# Altium schematic sheet Interfaces.SchDoc
size A2; Organization: Altium Limited; Address1: L3, 12a Rodborough Rd; Address2: Frenchs Forest; Address3: NSW; Address4: Australia 2086
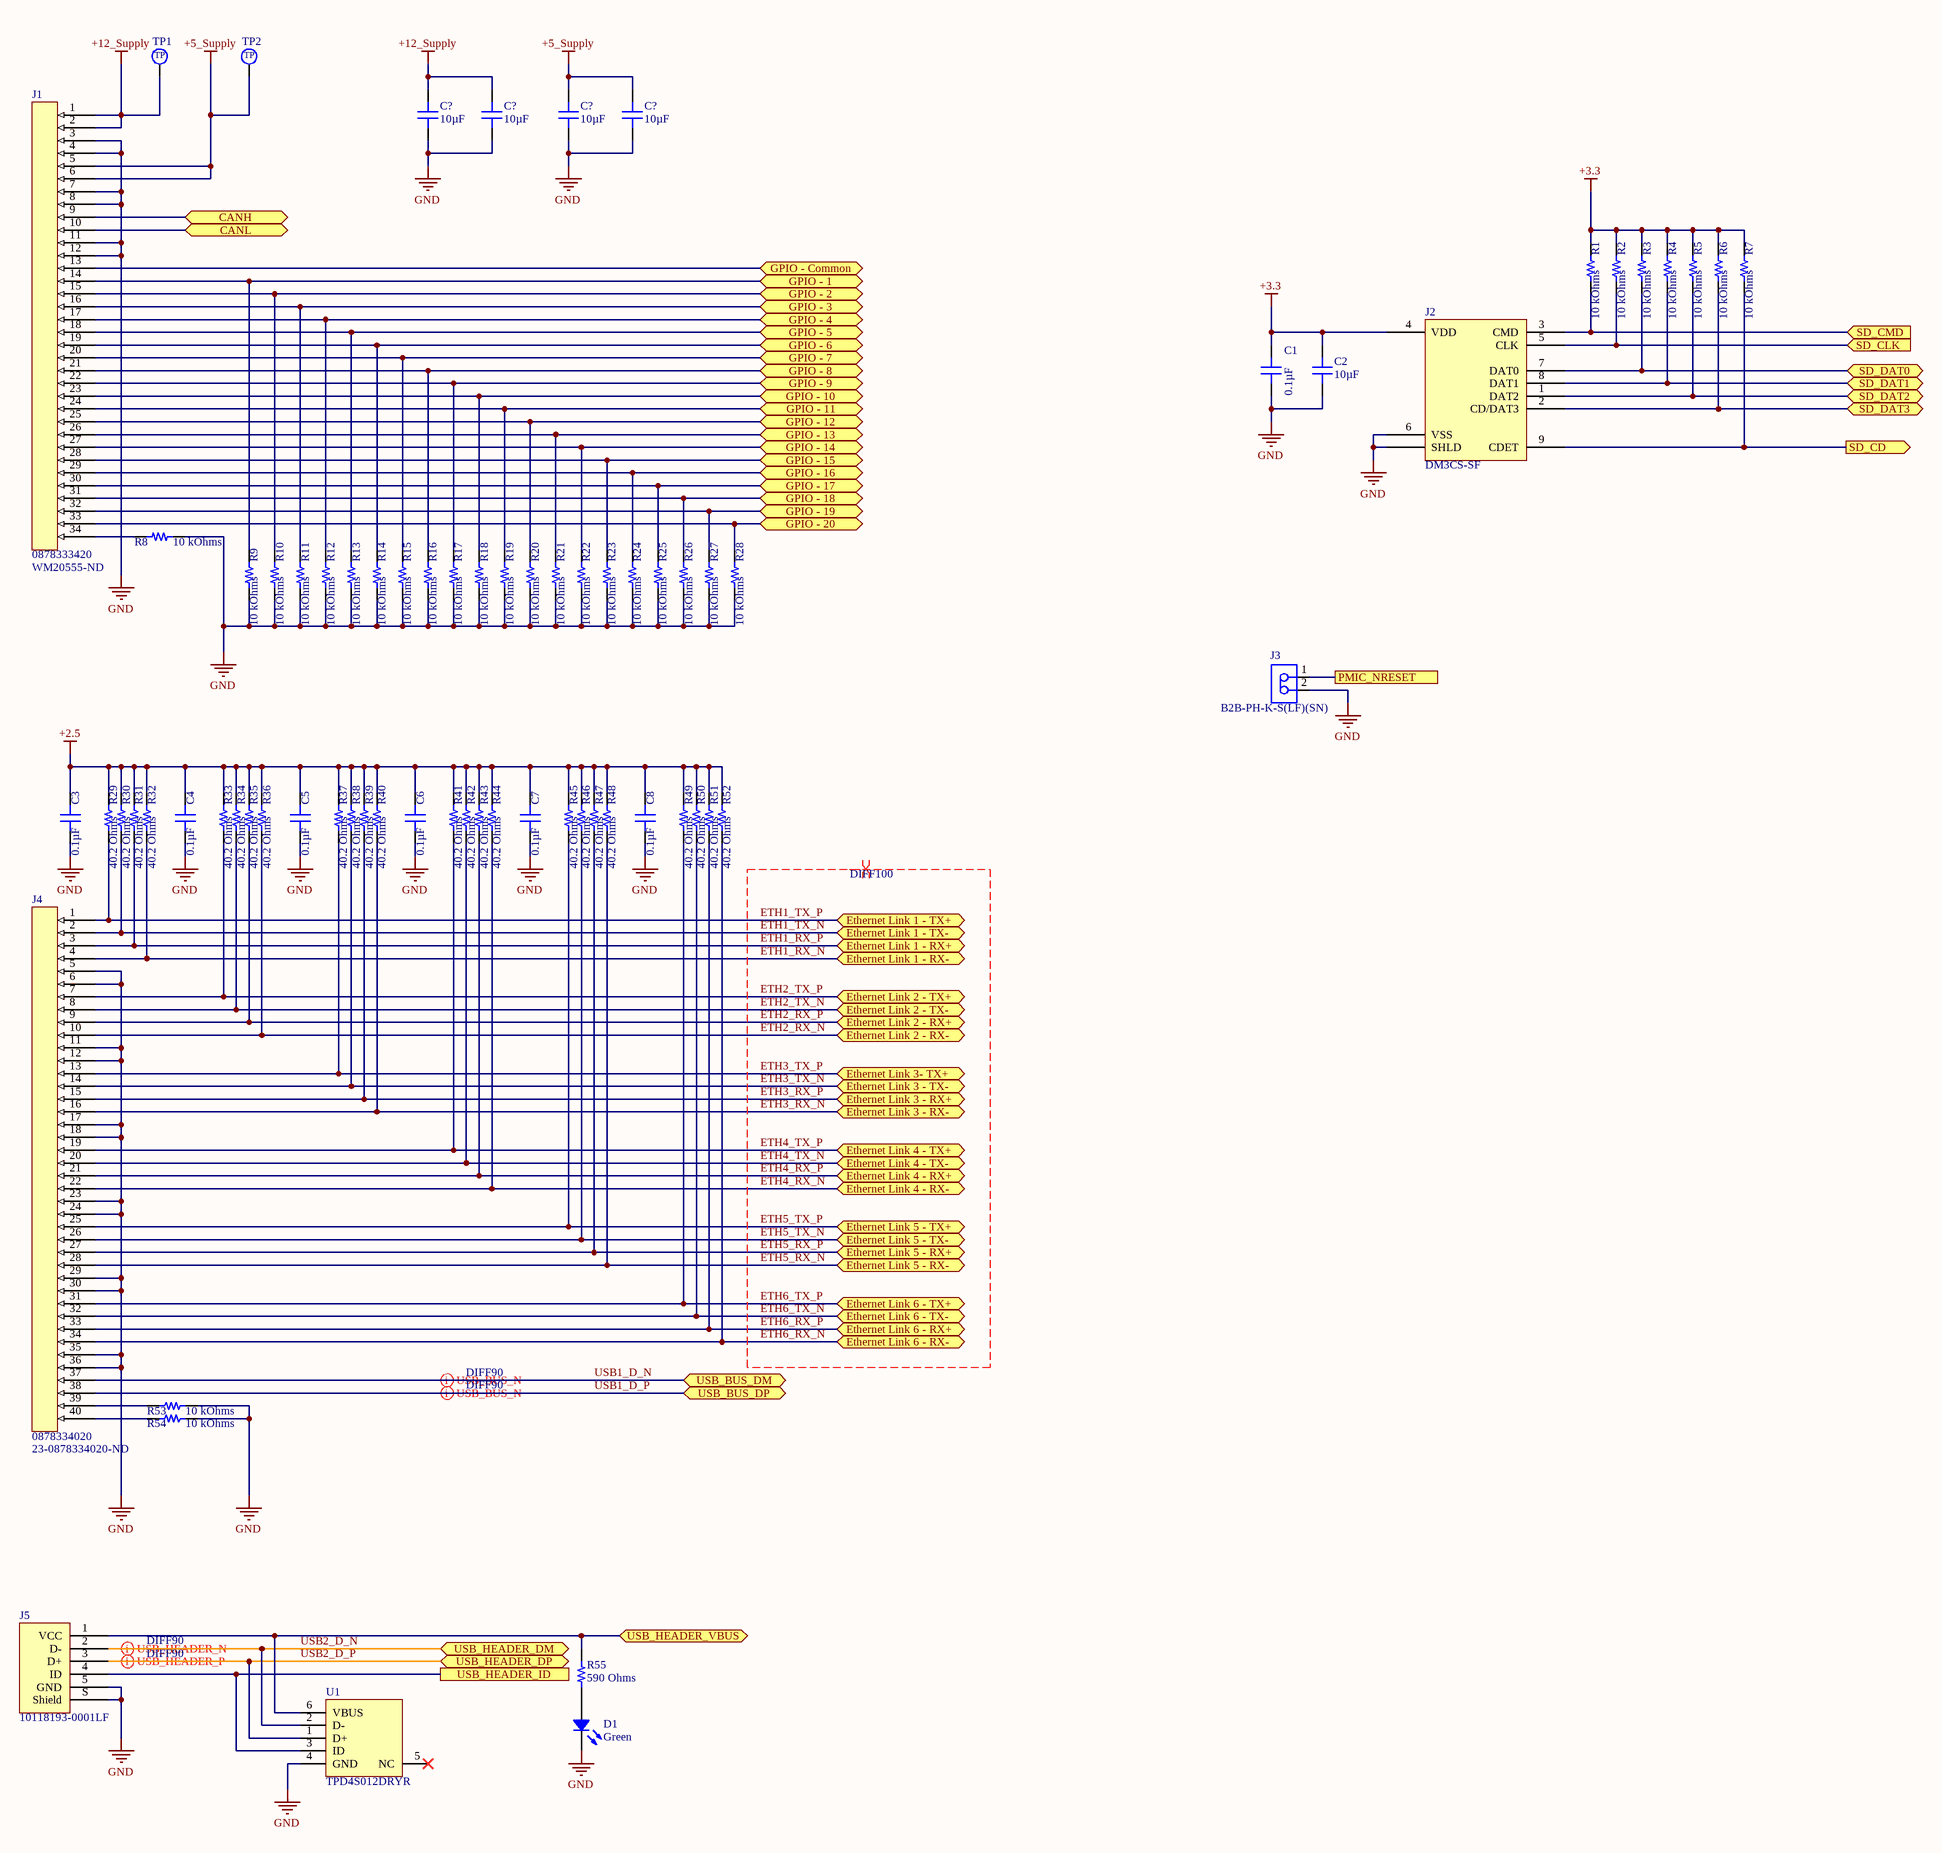
[diagram p0: Interfaces.SchDoc]

## Parts
(Parts that share a designator on the sheet are numbered #1, #2 ... from top to bottom, then left to right.)
C1  0.1µF  [CAP 0603_1608]
C2  10µF  [CAP 0805_2012]
C3  0.1µF  [CAP 0603_1608]
C4  0.1µF  [CAP 0603_1608]
C5  0.1µF  [CAP 0603_1608]
C6  0.1µF  [CAP 0603_1608]
C7  0.1µF  [CAP 0603_1608]
C8  0.1µF  [CAP 0603_1608]
C?#1  10µF  [CAP 0805_2012]
C?#2  10µF  [CAP 0805_2012]
C?#3  10µF  [CAP 0805_2012]
C?#4  10µF  [CAP 0805_2012]
D1  Green  [LED 0603_1608 GREEN]
J1  0878333420  Supplier Part Number 1: WM20555-ND  [0878333420]
J2  DM3CS-SF  [HIROSE DM3CS]
J3  B2B-PH-K-S(LF)(SN)  [JST-B2B-PH-K-S_V]
J4  0878334020  Supplier Part Number 1: 23-0878334020-ND  [0878334020]
J5  10118193-0001LF  [FCI USB 10118193-0001LF]
R1  10 kOhms  [RES 0603_1608]
R2  10 kOhms  [RES 0603_1608]
R3  10 kOhms  [RES 0603_1608]
R4  10 kOhms  [RES 0603_1608]
R5  10 kOhms  [RES 0603_1608]
R6  10 kOhms  [RES 0603_1608]
R7  10 kOhms  [RES 0603_1608]
R8  10 kOhms  [RES 0603_1608]
R9  10 kOhms  [RES 0603_1608]
R10  10 kOhms  [RES 0603_1608]
R11  10 kOhms  [RES 0603_1608]
R12  10 kOhms  [RES 0603_1608]
R13  10 kOhms  [RES 0603_1608]
R14  10 kOhms  [RES 0603_1608]
R15  10 kOhms  [RES 0603_1608]
R16  10 kOhms  [RES 0603_1608]
R17  10 kOhms  [RES 0603_1608]
R18  10 kOhms  [RES 0603_1608]
R19  10 kOhms  [RES 0603_1608]
R20  10 kOhms  [RES 0603_1608]
R21  10 kOhms  [RES 0603_1608]
R22  10 kOhms  [RES 0603_1608]
R23  10 kOhms  [RES 0603_1608]
R24  10 kOhms  [RES 0603_1608]
R25  10 kOhms  [RES 0603_1608]
R26  10 kOhms  [RES 0603_1608]
R27  10 kOhms  [RES 0603_1608]
R28  10 kOhms  [RES 0603_1608]
R29  40.2 Ohms  [RES 0603_1608]
R30  40.2 Ohms  [RES 0603_1608]
R31  40.2 Ohms  [RES 0603_1608]
R32  40.2 Ohms  [RES 0603_1608]
R33  40.2 Ohms  [RES 0603_1608]
R34  40.2 Ohms  [RES 0603_1608]
R35  40.2 Ohms  [RES 0603_1608]
R36  40.2 Ohms  [RES 0603_1608]
R37  40.2 Ohms  [RES 0603_1608]
R38  40.2 Ohms  [RES 0603_1608]
R39  40.2 Ohms  [RES 0603_1608]
R40  40.2 Ohms  [RES 0603_1608]
R41  40.2 Ohms  [RES 0603_1608]
R42  40.2 Ohms  [RES 0603_1608]
R43  40.2 Ohms  [RES 0603_1608]
R44  40.2 Ohms  [RES 0603_1608]
R45  40.2 Ohms  [RES 0603_1608]
R46  40.2 Ohms  [RES 0603_1608]
R47  40.2 Ohms  [RES 0603_1608]
R48  40.2 Ohms  [RES 0603_1608]
R49  40.2 Ohms  [RES 0603_1608]
R50  40.2 Ohms  [RES 0603_1608]
R51  40.2 Ohms  [RES 0603_1608]
R52  40.2 Ohms  [RES 0603_1608]
R53  10 kOhms  [RES 0603_1608]
R54  10 kOhms  [RES 0603_1608]
R55  590 Ohms  [RES 0603_1608]
TP1  2.5mm_SMD_TestPoint  [2.5mm TestPoint]  (value not drawn)
TP2  2.5mm_SMD_TestPoint  [2.5mm TestPoint]  (value not drawn)
U1  TPD4S012DRYR  [DRY0006A]

## Ports
CANH (bidir), CANL (bidir), Ethernet Link 1 - RX+ (bidir), Ethernet Link 1 - RX- (bidir), Ethernet Link 1 - TX+ (bidir), Ethernet Link 1 - TX- (bidir), Ethernet Link 2 - RX+ (bidir), Ethernet Link 2 - RX- (bidir), Ethernet Link 2 - TX+ (bidir), Ethernet Link 2 - TX- (bidir), Ethernet Link 3 - RX+ (bidir), Ethernet Link 3 - RX- (bidir), Ethernet Link 3 - TX- (bidir), Ethernet Link 3- TX+ (bidir), Ethernet Link 4 - RX+ (bidir), Ethernet Link 4 - RX- (bidir), Ethernet Link 4 - TX+ (bidir), Ethernet Link 4 - TX- (bidir), Ethernet Link 5 - RX+ (bidir), Ethernet Link 5 - RX- (bidir), Ethernet Link 5 - TX+ (bidir), Ethernet Link 5 - TX- (bidir), Ethernet Link 6 - RX+ (bidir), Ethernet Link 6 - RX- (bidir), Ethernet Link 6 - TX+ (bidir), Ethernet Link 6 - TX- (bidir), GPIO - 1 (bidir), GPIO - 2 (bidir), GPIO - 3 (bidir), GPIO - 4 (bidir), GPIO - 5 (bidir), GPIO - 6 (bidir), GPIO - 7 (bidir), GPIO - 8 (bidir), GPIO - 9 (bidir), GPIO - 10 (bidir), GPIO - 11 (bidir), GPIO - 12 (bidir), GPIO - 13 (bidir), GPIO - 14 (bidir), GPIO - 15 (bidir), GPIO - 16 (bidir), GPIO - 17 (bidir), GPIO - 18 (bidir), GPIO - 19 (bidir), GPIO - 20 (bidir), GPIO - Common (bidir), PMIC_NRESET, SD_CD (out), SD_CLK (in), SD_CMD (in), SD_DAT0 (bidir), SD_DAT1 (bidir), SD_DAT2 (bidir), SD_DAT3 (bidir), USB_BUS_DM (bidir), USB_BUS_DP (bidir), USB_HEADER_DM (bidir), USB_HEADER_DP (bidir), USB_HEADER_ID, USB_HEADER_VBUS (bidir)

## Nets
+2.5: C3.2 C4.2 C5.2 C6.2 C7.2 C8.2 R29.2 R30.2 R31.2 R32.2 R33.2 R34.2 R35.2 R36.2 R37.2 R38.2 R39.2 R40.2 R41.2 R42.2 R43.2 R44.2 R45.2 R46.2 R47.2 R48.2 R49.2 R50.2 R51.2 R52.2
+3.3: C1.2 C2.2 J2.4(VDD) R1.2 R2.2 R3.2 R4.2 R5.2 R6.2 R7.2
+5_Supply: C?#3.2 C?#4.2 J1.5 J1.6 TP2.1
+12_Supply: C?#1.2 C?#2.2 J1.1 J1.2 TP1.1
GND: C1.1 C2.1 C3.1 C4.1 C5.1 C6.1 C7.1 C8.1 C?#1.1 C?#2.1 C?#3.1 C?#4.1 D1.2 J1.3 J1.4 J1.7 J1.8 J1.11 J1.12 J2.6(VSS) J2.S(SHLD) J3.2 J4.5 J4.6 J4.11 J4.12 J4.17 J4.18 J4.23 J4.24 J4.29 J4.30 J4.35 J4.36 J5.5(GND) J5.S(Shield) R8.2 R9.1 R10.1 R11.1 R12.1 R13.1 R14.1 R15.1 R16.1 R17.1 R18.1 R19.1 R20.1 R21.1 R22.1 R23.1 R24.1 R25.1 R26.1 R27.1 R28.1 R53.2 R54.2 U1.4(GND)
CANH: J1.9 ; port CANH
CANL: J1.10 ; port CANL
ETH1_RX_N: J4.4 R32.1 ; port Ethernet Link 1 - RX-
ETH1_RX_P: J4.3 R31.1 ; port Ethernet Link 1 - RX+
ETH1_TX_N: J4.2 R30.1 ; port Ethernet Link 1 - TX-
ETH1_TX_P: J4.1 R29.1 ; port Ethernet Link 1 - TX+
ETH2_RX_N: J4.10 R36.1 ; port Ethernet Link 2 - RX-
ETH2_RX_P: J4.9 R35.1 ; port Ethernet Link 2 - RX+
ETH2_TX_N: J4.8 R34.1 ; port Ethernet Link 2 - TX-
ETH2_TX_P: J4.7 R33.1 ; port Ethernet Link 2 - TX+
ETH3_RX_N: J4.16 R40.1 ; port Ethernet Link 3 - RX-
ETH3_RX_P: J4.15 R39.1 ; port Ethernet Link 3 - RX+
ETH3_TX_N: J4.14 R38.1 ; port Ethernet Link 3 - TX-
ETH3_TX_P: J4.13 R37.1 ; port Ethernet Link 3- TX+
ETH4_RX_N: J4.22 R44.1 ; port Ethernet Link 4 - RX-
ETH4_RX_P: J4.21 R43.1 ; port Ethernet Link 4 - RX+
ETH4_TX_N: J4.20 R42.1 ; port Ethernet Link 4 - TX-
ETH4_TX_P: J4.19 R41.1 ; port Ethernet Link 4 - TX+
ETH5_RX_N: J4.28 R48.1 ; port Ethernet Link 5 - RX-
ETH5_RX_P: J4.27 R47.1 ; port Ethernet Link 5 - RX+
ETH5_TX_N: J4.26 R46.1 ; port Ethernet Link 5 - TX-
ETH5_TX_P: J4.25 R45.1 ; port Ethernet Link 5 - TX+
ETH6_RX_N: J4.34 R52.1 ; port Ethernet Link 6 - RX-
ETH6_RX_P: J4.33 R51.1 ; port Ethernet Link 6 - RX+
ETH6_TX_N: J4.32 R50.1 ; port Ethernet Link 6 - TX-
ETH6_TX_P: J4.31 R49.1 ; port Ethernet Link 6 - TX+
GPIO - 1: J1.14 R9.2 ; port GPIO - 1
GPIO - 2: J1.15 R10.2 ; port GPIO - 2
GPIO - 3: J1.16 R11.2 ; port GPIO - 3
GPIO - 4: J1.17 R12.2 ; port GPIO - 4
GPIO - 5: J1.18 R13.2 ; port GPIO - 5
GPIO - 6: J1.19 R14.2 ; port GPIO - 6
GPIO - 7: J1.20 R15.2 ; port GPIO - 7
GPIO - 8: J1.21 R16.2 ; port GPIO - 8
GPIO - 9: J1.22 R17.2 ; port GPIO - 9
GPIO - 10: J1.23 R18.2 ; port GPIO - 10
GPIO - 11: J1.24 R19.2 ; port GPIO - 11
GPIO - 12: J1.25 R20.2 ; port GPIO - 12
GPIO - 13: J1.26 R21.2 ; port GPIO - 13
GPIO - 14: J1.27 R22.2 ; port GPIO - 14
GPIO - 15: J1.28 R23.2 ; port GPIO - 15
GPIO - 16: J1.29 R24.2 ; port GPIO - 16
GPIO - 17: J1.30 R25.2 ; port GPIO - 17
GPIO - 18: J1.31 R26.2 ; port GPIO - 18
GPIO - 19: J1.32 R27.2 ; port GPIO - 19
GPIO - 20: J1.33 R28.2 ; port GPIO - 20
GPIO - Common: J1.13 ; port GPIO - Common
PMIC_NRESET: J3.1 ; port PMIC_NRESET
SD_CD: J2.9(CDET) R7.1 ; port SD_CD
SD_CLK: J2.5(CLK) R2.1 ; port SD_CLK
SD_CMD: J2.3(CMD) R1.1 ; port SD_CMD
SD_DAT0: J2.7(DAT0) R3.1 ; port SD_DAT0
SD_DAT1: J2.8(DAT1) R4.1 ; port SD_DAT1
SD_DAT2: J2.1(DAT2) R5.1 ; port SD_DAT2
SD_DAT3: J2.2(CD/DAT3) R6.1 ; port SD_DAT3
USB1_D_N: J4.37 ; port USB_BUS_DM
USB1_D_P: J4.38 ; port USB_BUS_DP
USB2_D_N: J5.2(D-) U1.2(D-) ; port USB_HEADER_DM
USB2_D_P: J5.3(D+) U1.1(D+) ; port USB_HEADER_DP
USB_HEADER_ID: J5.4(ID) U1.3(ID) ; port USB_HEADER_ID
USB_HEADER_VBUS: J5.1(VCC) R55.2 U1.6(VBUS) ; port USB_HEADER_VBUS
NetD1_1: D1.1 R55.1
NetJ1_34: J1.34 R8.1
NetJ4_39: J4.39 R53.1
NetJ4_40: J4.40 R54.1

Not connected (* = marked no-connect by the designer): U1 5(NC)*

## Layout directives
differential pair; differential pair class DIFF90: USB1_D_N, USB1_D_P, USB2_D_N, USB2_D_P
differential pair; differential pair class DIFF100: ETH1_RX_N, ETH1_RX_P, ETH1_TX_N, ETH1_TX_P, ETH2_RX_N, ETH2_RX_P, ETH2_TX_N, ETH2_TX_P, ETH3_RX_N, ETH3_RX_P, ETH3_TX_N, ETH3_TX_P, ETH4_RX_N, ETH4_RX_P, ETH4_TX_N, ETH4_TX_P, ETH5_RX_N, ETH5_RX_P, ETH5_TX_N, ETH5_TX_P, ETH6_RX_N, ETH6_RX_P, ETH6_TX_N, ETH6_TX_P

## Notes on the sheet
- Title
- Size:
- Date:
- File:
- A2
- Number:
- Time:
- Revision:
- Sheet
- of
- (in symbol 2.5mm_SMD_TestPoint) TP

## Library data of the parts
C1 C3-C8 = CL10B104KA8WPNC: CAP CER 0.1UF 25V X7R 0603; Manufacturer: Samsung Electro-Mechanics; Tolerance: ±10%; Part Number: CL10B104KA8WPNC; Value: 0.1µF; Applications: Automotive; Capacitance: 0.1µF; ComponentLink1Description: Datasheet; ComponentLink1URL: http://www.samsungsem.com/kr/support/product-search/mlcc/CL10B104KA8WPNC.jsp; ComponentLink2Description: DigiKey Link; ComponentLink2URL: http://digikey.com/product-detail/en/samsung-electro-mechanics/CL10B104KA8WPNC/1276-6717-1-ND/5961576; Device Package: 0603 (1608 Metric); Features: Open Mode; LastUpdated: 9/2/2020 1:03:30 AM; Lifecycle Status: Active; Minimum Order: 1; Mounting Type: Surface Mount, MLCC; Operating Temperature: -55°C ~ 125°C; Package / Case: 0603 (1608 Metric); Packaging: TapeAndReel; PartId: 5631; Part Status: Active; Price: 0.02; Ratings: AEC-Q200; Series: CL; Size / Dimension: 0.063" L x 0.031" W (1.60mm x 0.80mm); Supplier 1: DigiKey; Supplier Part Number 1: 1276-6717-1-ND; Temperature Coefficient: X7R; Thickness (Max): 0.035" (0.90mm); Voltage - Rated: 25V
C2 C?#1-C?#4 = CC0805KKX5R7BB106: CAP CER 10UF 16V X5R 0805; Manufacturer: Yageo; Tolerance: ±10%; Part Number: CC0805KKX5R7BB106; Value: 10µF; Applications: General Purpose; Capacitance: 10µF; ComponentLink1Description: Datasheet; ComponentLink1URL: https://www.yageo.com/upload/media/product/productsearch/datasheet/mlcc/UPY-GPHC_X5R_4V-to-50V_25.pdf; ComponentLink2Description: DigiKey Link; ComponentLink2URL: http://digikey.com/product-detail/en/yageo/CC0805KKX5R7BB106/311-1865-1-ND/5195767; Device Package: 0805 (2012 Metric); LastUpdated: 9/2/2020 1:04:30 AM; Lifecycle Status: Active; Minimum Order: 1; Mounting Type: Surface Mount, MLCC; Operating Temperature: -55°C ~ 85°C; Package / Case: 0805 (2012 Metric); Packaging: TapeAndReel; PartId: 8867; Part Status: Active; Price: 0.09; Series: CC; Size / Dimension: 0.079" L x 0.049" W (2.00mm x 1.25mm); Supplier 1: DigiKey; Supplier Part Number 1: 311-1865-1-ND; Temperature Coefficient: X5R; Thickness (Max): 0.057" (1.45mm); Voltage - Rated: 16V
D1 = LTST-C193KGKT-5A: LED GREEN CLEAR CHIP SMD; Manufacturer: Lite-On Inc.; Configuration: Standard; Current - Test: 5mA; Lens Color: Colorless; Lens Size: 1.15mm x 0.80mm; Lens Style: Rectangle with Flat Top; Millicandela Rating: 16.25mcd; Viewing Angle: 130°; Voltage - Forward (Vf) (Typ): 2V; Wavelength - Dominant: 572nm; Wavelength - Peak: 574nm; Part Number: LTST-C193KGKT-5A; Color: Green; ComponentLink1Description: Datasheet; ComponentLink1URL: http://optoelectronics.liteon.com/upload/download/DS22-2007-0094/LTST-C193KGKT-5A.PDF; ComponentLink2Description: DigiKey Link; ComponentLink2URL: http://digikey.com/product-detail/en/lite-on-inc/LTST-C193KGKT-5A/160-1828-1-ND/2356247; Device Package: 0603 (1608 Metric); Height (Max): 0.45mm; LastUpdated: 9/2/2020 1:20:41 AM; Lens Transparency: Clear; Lifecycle Status: Active; Minimum Order: 1; Mounting Type: Surface Mount; Package / Case: 0603 (1608 Metric); Packaging: TapeAndReel; PartId: 694; Part Status: Active; Price: 0.06; Series: -; Size / Dimension: 1.60mm L x 0.80mm W; Supplier 1: DigiKey; Supplier Part Number 1: 160-1828-1-ND; Supplier Device Package: Chip LED; Value: Green
J2 = DM3CS-SF: CONN MICRO SD CARD HINGED TYPE; Manufacturer: Hirose Electric Co Ltd; Card Type: Secure Digital - microSD™; Connector Type: Connector; Insertion, Removal Method: Hinged Lid; Number of Positions: 10 (8 + 2); Part Number: DM3CS-SF; ComponentLink1Description: Datasheet; ComponentLink1URL: https://www.hirose.com/product/document?clcode=CL0609-0033-6-00&productname=DM3AT-SF-PEJ2M5&series=DM3&documenttype=Catalog&lang=en&documentid=D49662_en; ComponentLink2Description: DigiKey Link; ComponentLink2URL: //digikey.com/product-detail/en/hirose-electric-co-ltd/DM3CS-SF/HR1972TR-ND/2602739; Contact Finish: Gold; Features: Switch; Height Above Board: 0.072" (1.83mm); LastUpdated: 12/16/2019 8:36:12 PM; Lifecycle Status: 0; Minimum Order: 1; Mounting Feature: Normal, Standard - Top; Mounting Type: Surface Mount, Right Angle; Packaging: TapeAndReel; Part Status: Active; Price: 0.77; Series: DM3; Supplier 1: DigiKey; Supplier Part Number 1: HR1972TR-ND
J3 = CMP-2000-05162-1: Male Header, Pitch 2 mm, 1 x 2 Position, Height 6 mm, Tail Length 3.4 mm, -25 to 85 degC, RoHS, Bulk; Manufacturer: JST; Pitch: 2mm; Style/Orientation: StraightHeader/Plug; No of Positions: 2; Datasheet Version: Nov-08; Datasheet URL: http://datasheet.octopart.com/B2B-PH-K-S%28LF%29%28SN%29-JST-datasheet-8324864.pdf; Manufacturer URL: http://www.jst.com/home2.html; Type: ShroudedHeader; Termination: Crimp
J5 = 10118193-0001LF: CONN RCPT USB2.0 MICRO B SMD R/A; Manufacturer: Amphenol ICC (FCI); Connector Type: USB - micro B; Current Rating (Amps): 1.8A per Contact; Gender: Receptacle; Mating Cycles: 10000; Number of Contacts: 5; Number of Ports: 1; Shielding: Shielded; Voltage - Rated: 100VAC; Part Number: 10118193-0001LF; ComponentLink1Description: Datasheet; ComponentLink1URL: https://cdn.amphenol-icc.com/media/wysiwyg/files/documentation/datasheet/inputoutput/io_usb_micro.pdf; ComponentLink2Description: DigiKey Link; ComponentLink2URL: //digikey.com/product-detail/en/amphenol-icc-fci/10118193-0001LF/609-4616-2-ND/2785388; Features: Solder Retention; LastUpdated: 12/9/2019 8:51:28 PM; Lifecycle Status: 0; Minimum Order: 1; Mounting Feature: Horizontal; Mounting Type: Surface Mount, Right Angle; Through Hole; Operating Temperature: -30°C ~ 80°C; Packaging: TapeAndReel; Part Status: Active; Price: 0.21; Series: -; Specifications: USB 2.0; Supplier 1: DigiKey; Supplier Part Number 1: 609-4616-2-ND; Termination: Solder
R1-R28 R53 R54 = RMCF0603JT10K0: RES 10K OHM 5% 1/10W 0603; Manufacturer: Stackpole Electronics Inc; Power (Watts): 0.1W, 1/10W; Temperature Coefficient: ±200ppm/°C; Part Number: RMCF0603JT10K0; Value: 10 kOhms; ComponentLink1Description: Datasheet; ComponentLink1URL: https://www.seielect.com/catalog/sei-packaging.pdf; ComponentLink2Description: DigiKey Link; ComponentLink2URL: http://digikey.com/product-detail/en/stackpole-electronics-inc/RMCF0603JT10K0/RMCF0603JT10K0CT-ND/1943191; Composition: Thick Film; Device Package: 0603 (1608 Metric); Features: Automotive AEC-Q200; Height - Seated (Max): 0.022" (0.55mm); LastUpdated: 8/30/2020 8:48:45 PM; Lifecycle Status: Active; Minimum Order: 1; Number of Terminations: 2; Operating Temperature: -55°C ~ 155°C; Package / Case: 0603 (1608 Metric); Packaging: CutTape; PartId: 25659; Part Status: Active; Price: 0.10; Ratings: AEC-Q200; Resistance: 10 kOhms; Series: RMCF; Size / Dimension: 0.061" L x 0.031" W (1.55mm x 0.80mm); Supplier 1: DigiKey; Supplier Part Number 1: RMCF0603JT10K0CT-ND; Supplier Device Package: 0603; Tolerance: ±5%
R29-R52 = RC0603FR-0740R2L: RES SMD 40.2 OHM 1% 1/10W 0603; Manufacturer: Yageo; Power (Watts): 0.1W, 1/10W; Temperature Coefficient: ±100ppm/°C; Part Number: RC0603FR-0740R2L; Value: 40.2 Ohms; ComponentLink1Description: Datasheet; ComponentLink1URL: https://www.yageo.com/upload/media/product/productsearch/datasheet/rchip/PYu-RC_Group_51_RoHS_L_10.pdf; ComponentLink2Description: DigiKey Link; ComponentLink2URL: http://digikey.com/product-detail/en/yageo/RC0603FR-0740R2L/311-40.2HRCT-ND/730167; Composition: Thick Film; Device Package: 0603 (1608 Metric); Features: Moisture Resistant; Height - Seated (Max): 0.022" (0.55mm); LastUpdated: 9/2/2020 1:10:19 AM; Lifecycle Status: Active; Minimum Order: 1; Number of Terminations: 2; Operating Temperature: -55°C ~ 155°C; Package / Case: 0603 (1608 Metric); Packaging: CutTape; PartId: 7714; Part Status: Active; Price: 0.10; Resistance: 40.2 Ohms; Series: RC; Size / Dimension: 0.063" L x 0.031" W (1.60mm x 0.80mm); Supplier 1: DigiKey; Supplier Part Number 1: 311-40.2HRCT-ND; Supplier Device Package: 0603; Tolerance: ±1%
R55 = RMCF0603FT590R: RES 590 OHM 1% 1/10W 0603; Manufacturer: Stackpole Electronics Inc; Power (Watts): 0.1W, 1/10W; Temperature Coefficient: ±100ppm/°C; Part Number: RMCF0603FT590R; Value: 590 Ohms; ComponentLink1Description: Datasheet; ComponentLink1URL: https://www.seielect.com/catalog/sei-rmcf_rmcp.pdf; ComponentLink2Description: DigiKey Link; ComponentLink2URL: http://digikey.com/product-detail/en/stackpole-electronics-inc/RMCF0603FT590R/RMCF0603FT590RCT-ND/2418096; Composition: Thick Film; Device Package: 0603 (1608 Metric); Features: Automotive AEC-Q200; Height - Seated (Max): 0.022" (0.55mm); LastUpdated: 9/2/2020 1:09:40 AM; Lifecycle Status: Active; Minimum Order: 1; Number of Terminations: 2; Operating Temperature: -55°C ~ 155°C; Package / Case: 0603 (1608 Metric); Packaging: CutTape; PartId: 23847; Part Status: Active; Price: 0.10; Ratings: AEC-Q200; Resistance: 590 Ohms; Series: RMCF; Size / Dimension: 0.061" L x 0.031" W (1.55mm x 0.80mm); Supplier 1: DigiKey; Supplier Part Number 1: RMCF0603FT590RCT-ND; Supplier Device Package: 0603; Tolerance: ±1%
U1 = CMP-0326-00038-3: USB ESD Solution with Power Clamp, 4 Channels, -40 to +85 degC, 6-pin SON (DRY), Green (RoHS & no Sb/Br); Manufacturer: Texas Instruments; IO Capacitance(Typ)(pF): 0.8; USB High Speed: TRUE; IEC 61000-4-2 Air-Gap(+/- kV): 10; Breakdown Voltage(Min)(V): 6; PackageDescription: 6-Pin Plastic Small Outline No-Lead, 1 x 1.45 x 0.6 mm Body, 0.5 mm Pitch; ComponentLink2URL: http://www.ti.com/general/docs/lit/getliterature.tsp?genericPartNumber=TPD4S012&fileType=pdf; PackageVersion: revF, Dec-2011; ComponentLink3URL: SamplesURL:http://www.ti.com/product/tpd4s012#samples; ComponentLink2Description: Datasheet; IEC 61000-4-2 Contact(+/- kV): 10; DatasheetVersion: SLVS928A; PackageReference: DRY0006A; ComponentLink3Description: URL Link1; Mounting Technology: Surface Mount; PartNumber: TPD4S012DRYR; ComponentLink1Description: Manufacturer URL; SubFamily: ESD Solution; IO Leakage Current(nA): 10; ComponentLink1URL: http://www.ti.com/; Eco-Plan: Green (RoHS & no Sb/Br)
J1 = 0878333420: Supplier 1: Digi-Key
J4 = 0878334020: Supplier 1: Digi-Key